# Altium schematic sheet Sensors.SchDoc
size 393 x 281 mm; DocumentNumber: 6; SheetNumber: 6; SheetTotal: 7; Format: A3; Abteilung: Entwicklung
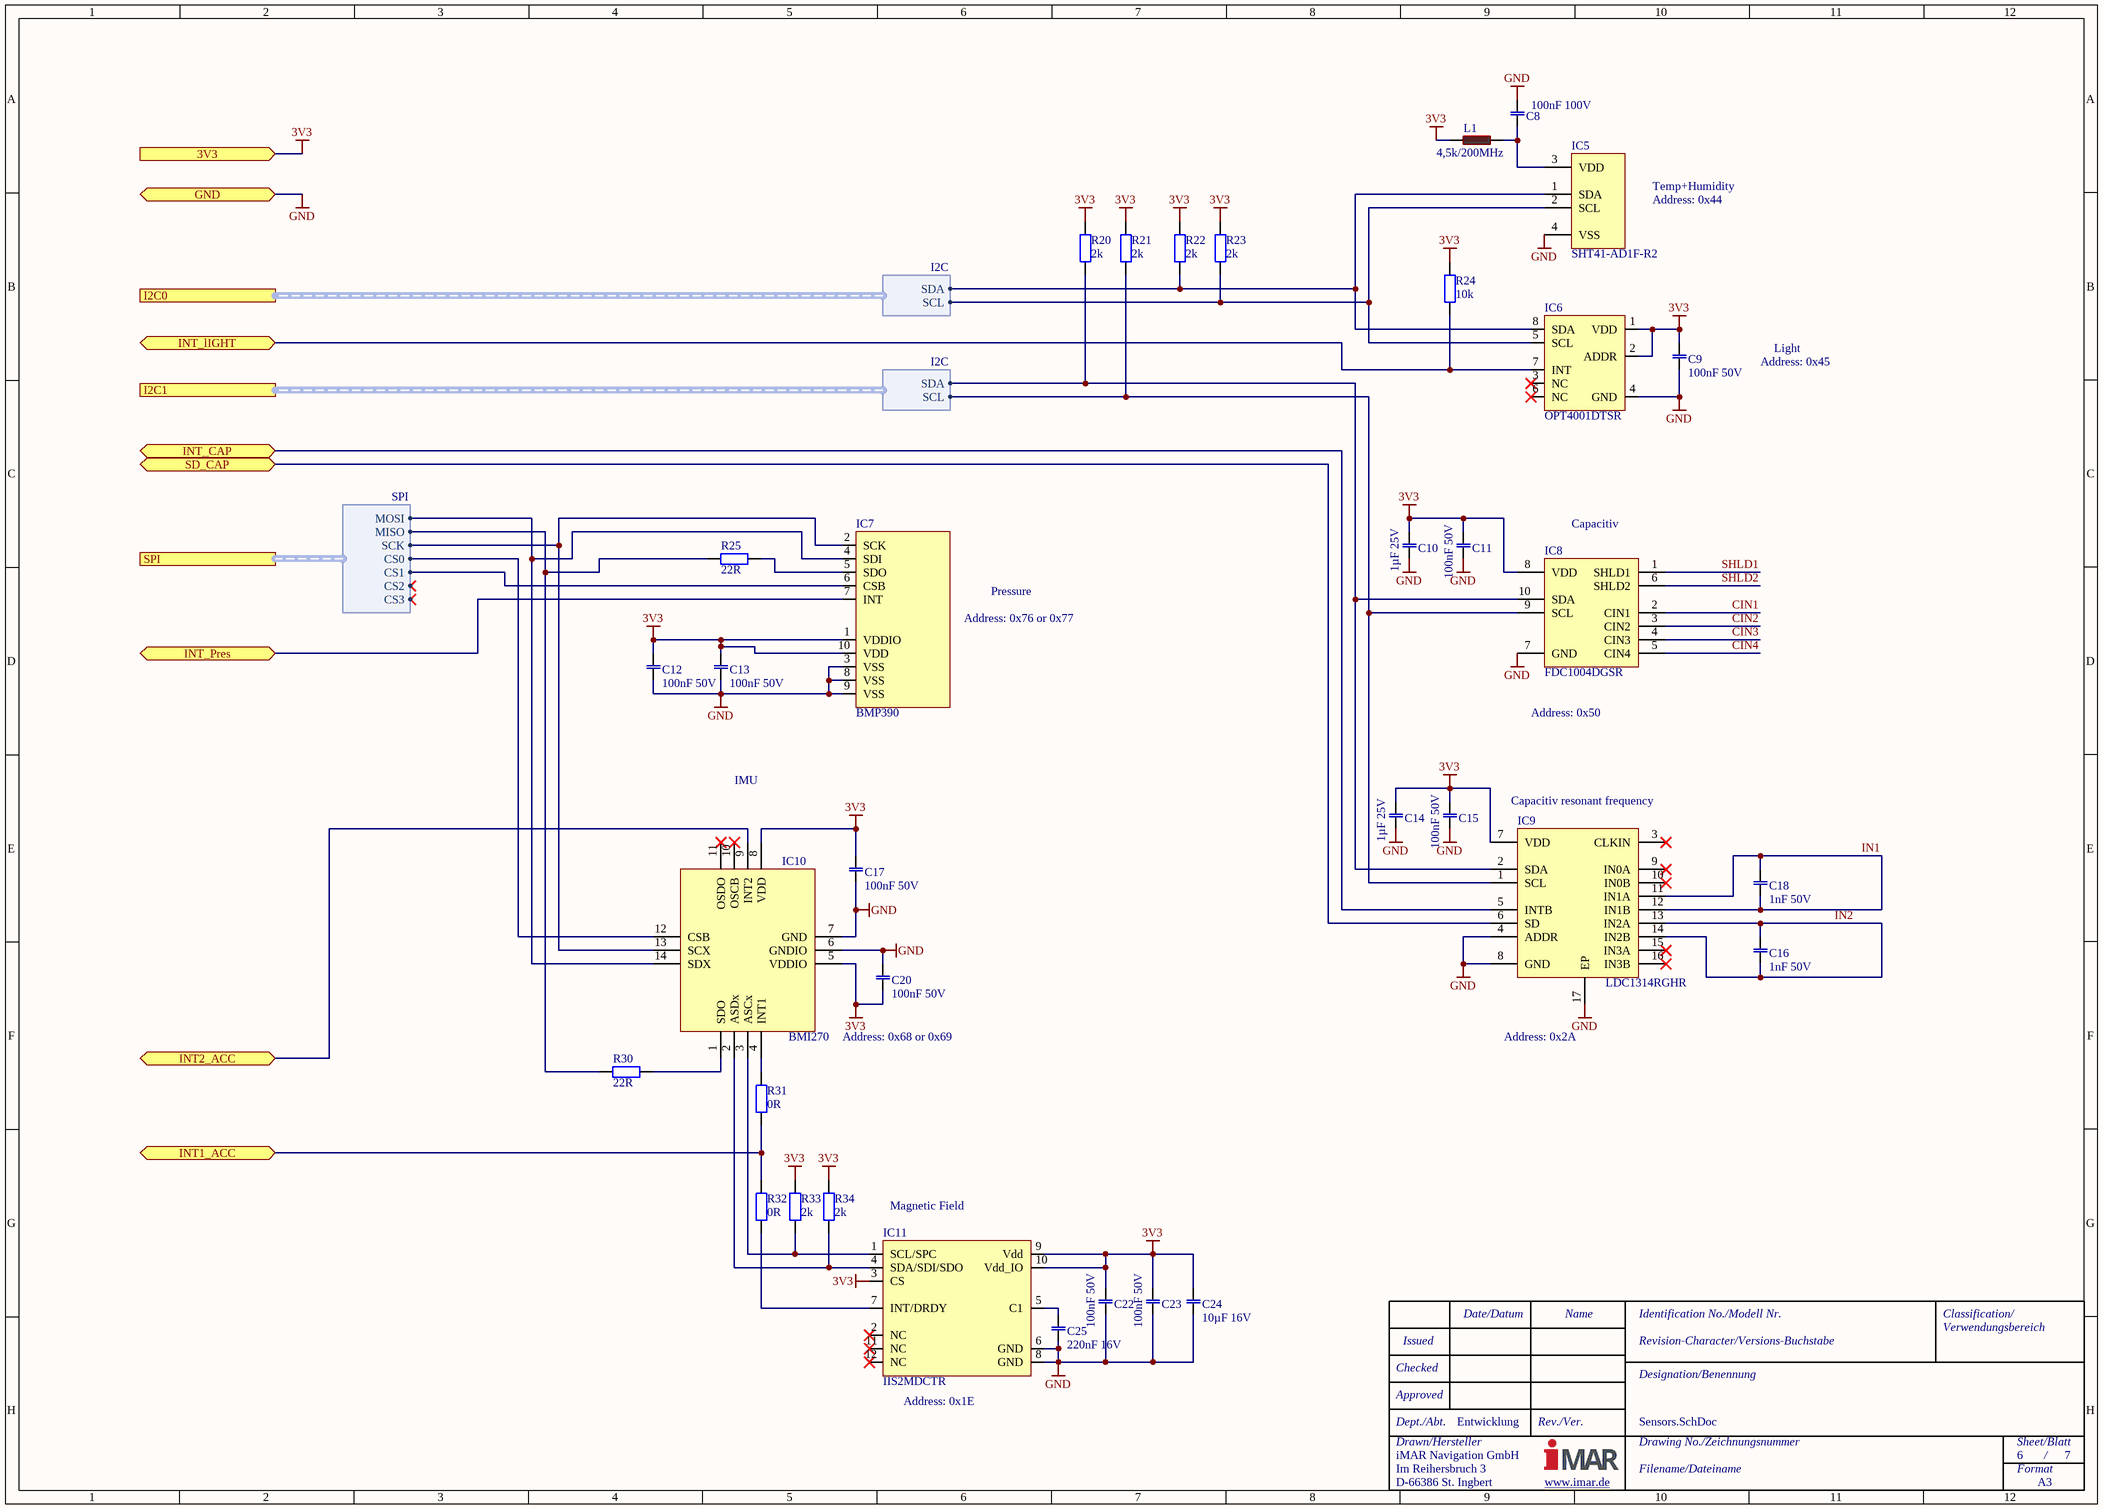
[diagram p0: Sensors.SchDoc]

## Parts
C8  100nF 100V  [CAPC1608L]
C9  100nF 50V  [CAPC1005N]
C10  1µF 25V  [CAPC1005N]
C11  100nF 50V  [CAPC1005N]
C12  100nF 50V  [CAPC1005N]
C13  100nF 50V  [CAPC1005N]
C14  1µF 25V  [CAPC1005N]
C15  100nF 50V  [CAPC1005N]
C16  1nF 50V  [CAPC1608L]
C17  100nF 50V  [CAPC1005N]
C18  1nF 50V  [CAPC1608L]
C20  100nF 50V  [CAPC1005N]
C22  100nF 50V  [CAPC1005N]
C23  100nF 50V  [CAPC1005N]
C24  10µF 16V  [CAPC1608L]
C25  220nF 16V  [CAPC1005N]
IC5  SHT41-AD1F-R2  [SENSIRION_SHT4x]
IC6  OPT4001DTSR  [SOT50P160X60-8N]
IC7  BMP390  [BMP390]
IC8  FDC1004DGSR  [TSSOP50P490X110-10N]
IC9  LDC1314RGHR  [QFN65P400X400X80_HS-17N]
IC10  BMI270  [BOSCH_LGA14_BMI_vergroesserte_Pads]
IC11  IIS2MDCTR  [ST_IIS2MDCTR_LGA12C50P4X4_200X200X70]
L1  4,5k/200MHz  [IND_WE_CBF_0603_Wide_Band]
R20  2k  [RESC1005L]
R21  2k  [RESC1005L]
R22  2k  [RESC1005L]
R23  2k  [RESC1005L]
R24  10k  [RESC1005L]
R25  22R  [RESC1005L]
R30  22R  [RESC1005L]
R31  0R  [RESC1005L]
R32  0R  [RESC1005L]
R33  2k  [RESC1005L]
R34  2k  [RESC1005L]

## Ports
3V3 (in), GND (bidir), I2C0 (harness I2C), I2C1 (harness I2C), INT1_ACC (bidir), INT2_ACC (bidir), INT_CAP (bidir), INT_lIGHT (bidir), INT_Pres (bidir), SD_CAP (bidir), SPI (harness SPI)

## Harnesses
I2C: SCL, SDA
SPI: CS0, MISO, MOSI, SCK, CS1, CS2, CS3

## Nets
3V3: C9.2 C10.2 C11.2 C12.2 C13.2 C14.2 C15.2 C17.2 C20.1 C22.2 C23.2 C24.2 IC6.1(VDD) IC6.2(ADDR) IC7.1(VDDIO) IC7.10(VDD) IC8.8(VDD) IC9.7(VDD) IC10.5(VDDIO) IC10.8(VDD) IC11.3(CS) IC11.9(Vdd) IC11.10(Vdd_IO) L1.1 R20.2 R21.2 R22.2 R23.2 R24.2 R33.2 R34.2 ; port 3V3
GND: C8.1 C9.1 C10.1 C11.1 C12.1 C13.1 C14.1 C15.1 C17.1 C20.2 C22.1 C23.1 C24.1 C25.2 IC5.4(VSS) IC6.4(GND) IC7.3(VSS) IC7.8(VSS) IC7.9(VSS) IC8.7(GND) IC9.4(ADDR) IC9.8(GND) IC9.17(EP) IC10.6(GNDIO) IC10.7(GND) IC11.6(GND) IC11.8(GND) ; port GND
CIN1: IC8.2(CIN1)
CIN2: IC8.3(CIN2)
CIN3: IC8.4(CIN3)
CIN4: IC8.5(CIN4)
IN1: C18.1 C18.2 IC9.11(IN1A) IC9.12(IN1B)
IN2: C16.1 C16.2 IC9.13(IN2A) IC9.14(IN2B)
INT1_ACC: R31.1 R32.2 ; port INT1_ACC
INT2_ACC: IC10.9(INT2) ; port INT2_ACC
INT_CAP: IC9.5(INTB) ; port INT_CAP
INT_lIGHT: IC6.7(INT) R24.1 ; port INT_lIGHT
INT_Pres: IC7.7(INT) ; port INT_Pres
SD_CAP: IC9.6(SD) ; port SD_CAP
SHLD1: IC8.1(SHLD1)
SHLD2: IC8.6(SHLD2)
NetC8_2: C8.2 IC5.3(VDD) L1.2
NetC25_1: C25.1 IC11.5(C1)
NetIC5_1: IC5.1(SDA) IC6.8(SDA) R22.1 ; port I2C0.SDA
NetIC5_2: IC5.2(SCL) IC6.5(SCL) R23.1 ; port I2C0.SCL
NetIC7_2: IC7.2(SCK) IC10.13(SCX) ; port SPI.SCK
NetIC7_4: IC7.4(SDI) IC10.14(SDX) ; port SPI.MOSI
NetIC7_5: IC7.5(SDO) R25.2
NetIC7_6: IC7.6(CSB) ; port SPI.CS1
NetIC8_9: IC8.9(SCL) IC9.1(SCL) R21.1 ; port I2C1.SCL
NetIC8_10: IC8.10(SDA) IC9.2(SDA) R20.1 ; port I2C1.SDA
NetIC10_1: IC10.1(SDO) R30.2
NetIC10_2: IC10.2(ASDx) IC11.4(SDA/SDI/SDO) R34.1
NetIC10_3: IC10.3(ASCx) IC11.1(SCL/SPC) R33.1
NetIC10_4: IC10.4(INT1) R31.2
NetIC10_12: IC10.12(CSB) ; port SPI.CS0
NetIC11_7: IC11.7(INT/DRDY) R32.1
NetR25_1: R25.1 R30.1 ; port SPI.MISO

Not connected (* = marked no-connect by the designer): IC6 3(NC)* 6(NC)*; IC9 3(CLKIN)* 9(IN0A)* 10(IN0B)* 15(IN3A)* 16(IN3B)*; IC10 10(OSCB)* 11(OSDO)*; IC11 2(NC)* 11(NC)* 12(NC)*

## Notes on the sheet
- Temp+Humidity
- Address: 0x44
- Address: 0x45
- Light
- (near IC8) Capacitiv
- Address: 0x76 or 0x77
- Pressure
- Address: 0x50
- IMU
- (near IC9) Capacitiv resonant frequency
- (near IC10) Address: 0x68 or 0x69
- Address: 0x2A
- Magnetic Field
- (near IC11) Address: 0x1E
- Date/Datum
- Name
- Identification No./Modell Nr.
- Classification/
- Checked
- Approved
- Issued
- Designation/Benennung
- Revision-Character/Versions-Buchstabe
- Verwendungsbereich
- Drawn/Hersteller
- Dept./Abt.
- iMAR Navigation GmbH
- Rev./Ver.
- Drawing No./Zeichnungsnummer
- Sheet/Blatt
- /
- Im Reihersbruch 3
- D-66386 St. Ingbert
- www.imar.de <http://www.imar.de>
- Filename/Dateiname
- Format
- A3

## Library data of the parts
C8 = CMP-002-0220-3: 100nF  100V  Ceramic  0603  10%  X7R; Manufacturer_PN: unspecified; Failure_in_Time_value: 0,000123; iMAR_PN: 00001-08261-0000; Temperature_min: -55°C; Failure_in_Time_notes: 55°C, 90% Upper Confidence Level, Daten von Wuerth verwendet; Temperature_max: 125°C; Value: 100nF; Mount: SMD; Kategorie: X7R; Case/Package: 0603; iComment: 100nF 100V; Voltage: 100V; Manufacturer: unspecified; RoHS: Yes; Tolerance: 10%; Capacitor_Type: Ceramic
C9 C11-C13 C15 C17 C20 C22 C23 = CMP-002-0216-3: 100nF  50V  Ceramic  0402  10%  X7R; Manufacturer_PN: unspecified; Failure_in_Time_notes: 55°C, 90% Upper Confidence Level, Daten von Wuerth verwendet; Failure_in_Time_value: 0,000123; Temperature_min: -55°C; iMAR_PN: 00001-08791-0000; Temperature_max: 125°C; iComment: 100nF 50V; Capacitor_Type: Ceramic; Voltage: 50V; Mount: SMD; Case/Package: 0402; Manufacturer: unspecified; Kategorie: X7R; Tolerance: 10%; RoHS: Yes; Value: 100nF
C10 C14 = CMP-002-0152-6: 1µF  25V  Ceramic  0402  10%  X5R; Manufacturer_PN: unspecified; iMAR_PN: 00001-07601-0000; Temperature_max: 85°C; Temperature_min: -55°C; RoHS: Yes; Mount: SMD; iComment: 1µF 25V; Voltage: 25V; Capacitor_Type: Ceramic; Kategorie: X5R; Manufacturer: unspecified; Value: 1µF; Case/Package: 0402; Tolerance: 10%
C16 C18 = CMP-0001-00018-3: 1nF 50V Ceramic 0603 1% C0G(NP0); Manufacturer: VISHAY; Manufacturer_PN: VJ0603A102FXACW1BC; Temperature_max: 125°C; iMAR_PN: 00001-09139-0000; Temperature_min: -55°C; Mount: SMD; Tolerance: 1%; RoHS: Yes; Capacitor_Type: Ceramic; iComment: 1nF 50V; Kategorie: C0G(NP0); Case/Package: 0603; Value: 1nF; Voltage: 50V
C24 = CMP-002-0021-13: 10µF  16V  Ceramic  0603  10%  X5R; Manufacturer_PN: unspecified; Failure_in_Time_value: 0,000123; iMAR_PN: 00001-08334-0001; Temperature_min: -55°C; Temperature_max: 85°C; Failure_in_Time_notes: 55°C, 90% Upper Confidence Level, Daten von Wuerth verwendet; Case/Package: 0603; Kategorie: X5R; iComment: 10µF 16V; Tolerance: 10%; Mount: SMD; RoHS: Yes; Value: 10µF; Capacitor_Type: Ceramic; Manufacturer: unspecified; Voltage: 16V
C25 = CMP-002-0142-8: 220nF  16V  Ceramic  0402  10%  X7R; Manufacturer: unspecified; Temperature_min: -55°C; Temperature_max: 125°C; iMAR_PN: 00001-08053-0000; Voltage: 16V; Mount: SMD; Kategorie: X7R; Manufacturer_PN: unspecified; Value: 220nF; Case/Package: 0402; Tolerance: 10%; RoHS: Yes; Capacitor_Type: Ceramic; iComment: 220nF 16V
IC5 = CMP-ROOT-00469-2: Digital humidity and temperature sensor, ±1.8% / max. ±3.5% RH; Manufacturer: SENSIRION; Temperature_max: 125°C; Typ: Temperature/Humidity; Temperature_min: -40°C; iMAR_PN: 00500-35042-0001; RoHS: Yes; Manufacturer_PN: SHT41-AD1F-R2; Mount: SMD; Case/Package: DFN; Pins: 4
IC6 = CMP-ROOT-00519-1: High-speed high-precision digital ambient light sensor (ALS); Manufacturer: TEXAS INSTRUMENTS; Temperature_min: -40°C; Temperature_max: 85°C; 3TG_Conformity: Yes; Manufacturer_PN: OPT4001DTSR; Mount: SMD; Pins: 8; Typ: Light; RoHS: Yes; Case/Package: SOT5X3
IC7 = CMP-ROOT-00308-4: Pressure Sensor; Manufacturer: BOSCH; Temperature_min: -40°C; Temperature_max: 85°C; iMAR_PN: 00500-35035-0001; Pins: 10; Manufacturer_PN: BMP390; Mount: SMD; Case/Package: LGA10; RoHS: Yes
IC8 = CMP-006-0133-1: 4-Channel Capacitance-to-Digital Converter for Capacitive Sensing Applications; Manufacturer: TEXAS INSTRUMENTS; 3TG_Conformity: Yes; Temperature_max: 125°C; Temperature_min: -40°C; Manufacturer_PN: FDC1004DGSR; Mount: SMD; Pins: 10; RoHS: Yes; Case/Package: VSSOP
IC9 = CMP-006-0132-1: Data Acquisition ADCs/DACs - Specialised 12-bit Inductance- t o-Digital Converter; Manufacturer: TEXAS INSTRUMENTS; iMAR_PN: tbd; Temperature_max: 125°C; Temperature_min: -40°C; 3TG_Conformity: Yes; Pins: 16; Mount: SMD; Case/Package: QFN-16; Manufacturer_PN: LDC1314RGHR; RoHS: Yes
IC10 = CMP-ROOT-00126-2: 6-axis, smart, low-power Inertial Measurement Unit; Manufacturer: BOSCH; Typ: IMU; Temperature_max: 85°C; iMAR_PN: 00500-21006-0001; Temperature_min: -40°C; Manufacturer_PN: BMI270; Pins: 14; Mount: SMD; Case/Package: LGA14; RoHS: Yes
IC11 = CMP-ROOT-00520-1: High accuracy, ultra-low-power ,3-axis digital output magnetometer; Manufacturer: ST Microelectronics; Temperature_max: 85°C; Temperature_min: -40°C; 3TG_Conformity: Yes; Mount: SMD; Manufacturer_PN: IIS2MDCTR; RoHS: Yes; Case/Package: LGA-12; Pins: 12; Typ: Magnetometer
L1 = CMP-007-0061-8: 4,5k/200MHz  500mA  0603  WE-CBF SMD EMI Suppression Ferrite Bead; Manufacturer: WUERTH ELEKTRONIK; Manufacturer_PN: 742792653; Frequency: 200MHz; Impedance: 4.5k; Temperature_max: 85°C; Temperature_min: -55°C; Failure_in_Time_notes: 90% UCL (lambda: 0,13; sigma: 0,09); Failure_in_Time_value: 0,00025; Impedance_100MHz: 600; Impedance_DC: 0.65; Temperature_extended: 125°C; iMAR_PN: 00001-04551-0000; Case/Package: 0603; Mount: SMD; RoHS: Yes; Current_Rated: 500mA
R20-R23 R33 R34 = CMP-001-0253-23: 2k  0402  62mW  1%  100ppm  50V; Manufacturer_PN: unspecified; Failure_in_Time_notes: 55°C, 60% Upper Confidence Level; Daten von Vishay verwendet; Failure_in_Time_value: 0,0001; Temperature_min: -40°C; iMAR_PN: 00001-07598-0000; TK: ±100; Temperature_max: 125°C; Power: 62mW; Case/Package: 0402; Tolerance: 1%; Voltage: 50V; RoHS: Yes; Manufacturer: unspecified; iComment: 2k; Value: 2k; Mount: SMD
R24 = CMP-001-0270-23: 10k  0402  62mW  1%  100ppm  50V; Manufacturer: unspecified; Failure_in_Time_notes: 55°C, 60% Upper Confidence Level; Daten von Vishay verwendet; Failure_in_Time_value: 0,0001; Temperature_min: -40°C; TK: ±100; iMAR_PN: 00001-06144-0004; Temperature_max: 125°C; RoHS: Yes; Value: 10k; Mount: SMD; iComment: 10k; Case/Package: 0402; Power: 62mW; Manufacturer_PN: unspecified; Tolerance: 1%; Voltage: 50V
R25 R30 = CMP-001-0206-25: 22R  0402  62mW  1%  100ppm  50V; Manufacturer: unspecified; iComment: 22; Temperature_min: -40°C; Failure_in_Time_value: 0,0001; TK: ±100; Failure_in_Time_notes: 55°C, 60% Upper Confidence Level; Daten von Vishay verwendet; Temperature_max: 125°C; Value: 22; iMAR_PN: 00001-07283-0000; RoHS: Yes; Power: 62mW; Manufacturer_PN: unspecified; Case/Package: 0402; Tolerance: 1%; Voltage: 50V; Mount: SMD
R31 R32 = CMP-001-0173-26: 0R  0402  0mW  0%  0ppm  0V; Manufacturer: unspecified; iMAR_PN: 00001-06483-0000; Temperature_min: -40°C; Failure_in_Time_notes: 55°C, 60% Upper Confidence Level; Daten von Vishay verwendet; iComment: 0; Power: 0W; Failure_in_Time_value: 0,0001; Value: 0; Temperature_max: 125°C; Voltage: 0V; Case/Package: 0402; Mount: SMD; Tolerance: 0%; TK: 0; RoHS: Yes; Manufacturer_PN: unspecified